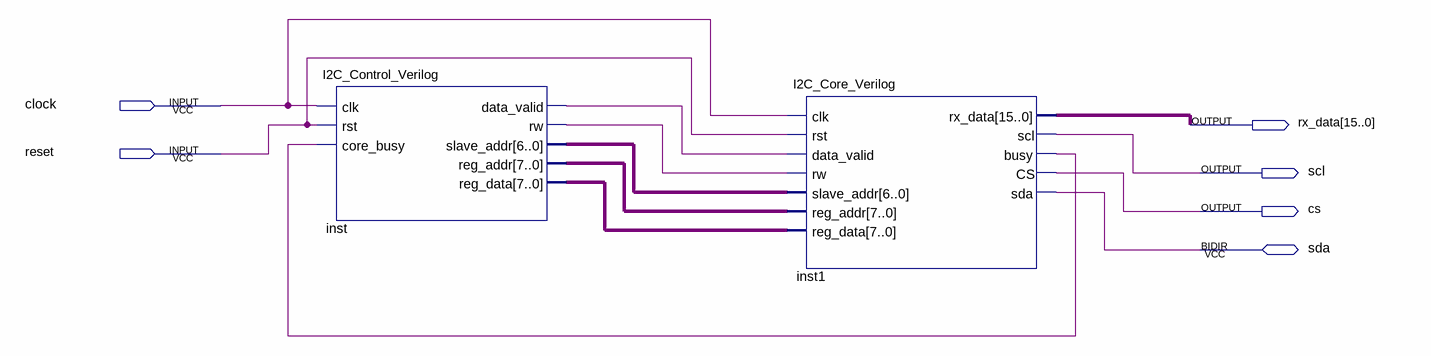
[diagram p0: schematic sheet]
// Quartus schematic I2C.bdf as structural Verilog: 2 symbols, 6 pins
module I2C (
  input  clock,
  input  reset,
  inout  sda,
  output [15:0] rx_data,
  output scl,
  output cs
);

  wire inst1_busy, inst_data_valid, inst_rw;
  wire [6:0] inst_slave_addr;
  wire [7:0] inst_reg_addr, inst_reg_data;

  I2C_Control_Verilog inst (
    .clk(clock), .rst(reset), .core_busy(inst1_busy), .data_valid(inst_data_valid), .rw(inst_rw),
    .slave_addr(inst_slave_addr), .reg_addr(inst_reg_addr), .reg_data(inst_reg_data));
  I2C_Core_Verilog inst1 (
    .clk(clock), .rst(reset), .data_valid(inst_data_valid), .rw(inst_rw), .slave_addr(inst_slave_addr),
    .reg_addr(inst_reg_addr), .reg_data(inst_reg_data), .rx_data(rx_data), .scl(scl), .busy(inst1_busy),
    .CS(cs), .sda(sda));
endmodule
